# Altium schematic sheet Top-level.SchDoc: nRF54L15 miniDevKit
size A4; Date: 15.03.2026; Author: Vamsi Krishna Sesham; DrawnBy: Vamsi Krishna Sesham; Revision: C; SheetNumber: 1; SheetTotal: 6
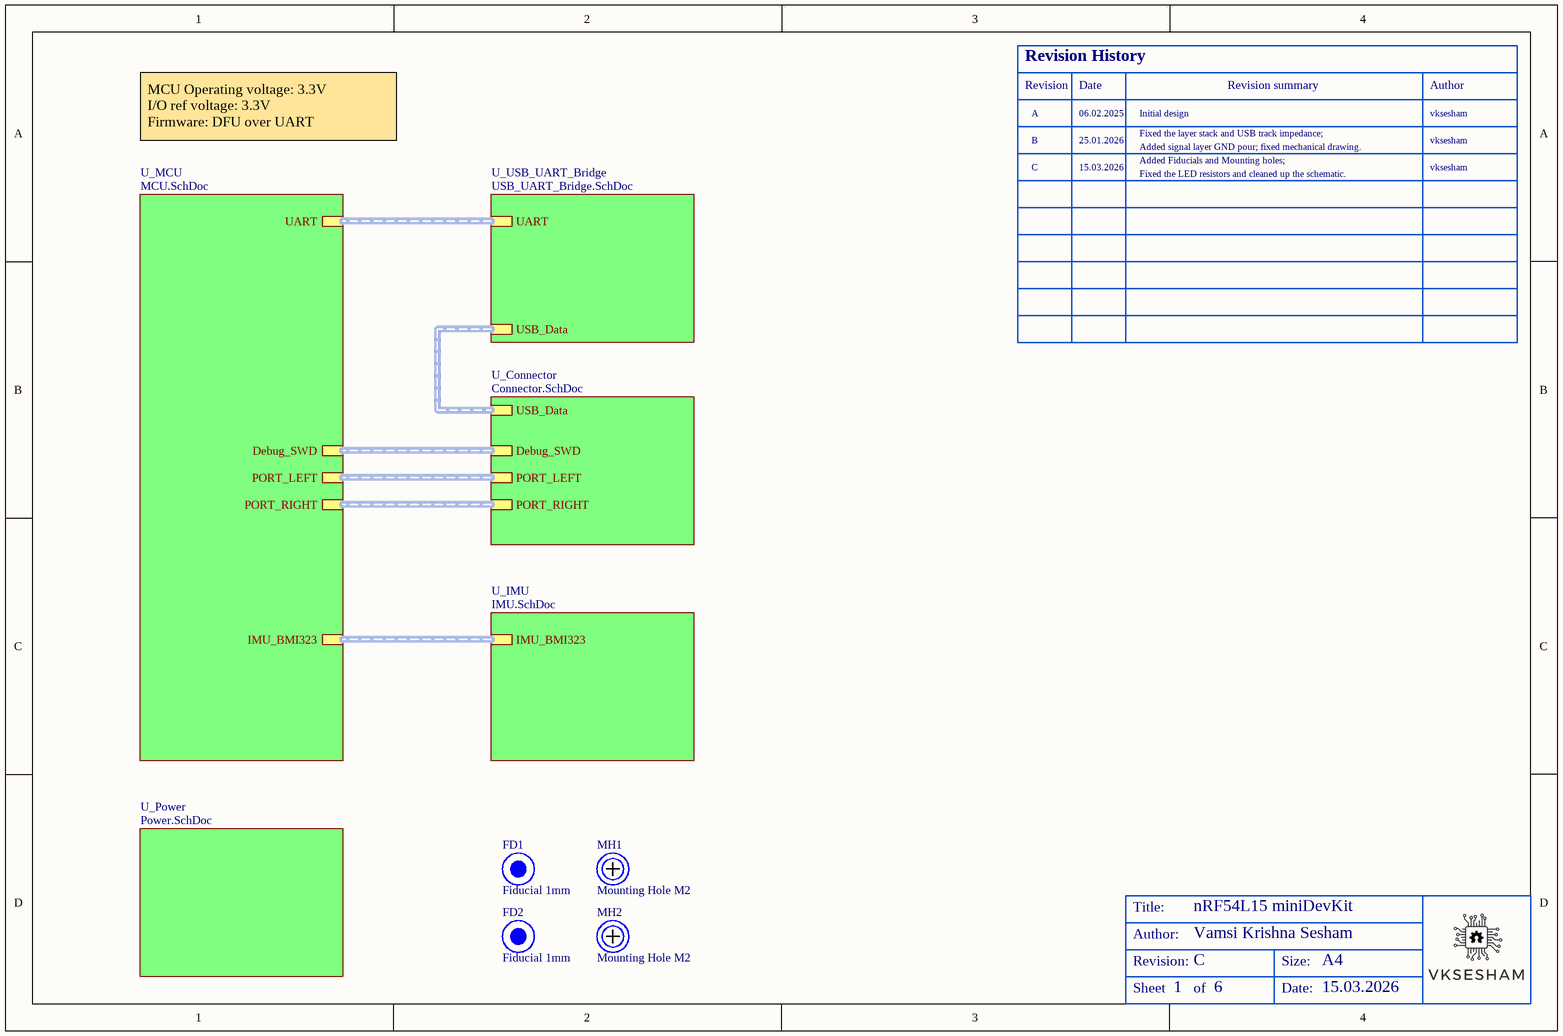
[diagram p0: Top-level.SchDoc]

## Parts
(Parts that share a designator on the sheet are numbered #1, #2 ... from top to bottom, then left to right.)
*#1  RevisionHistory  (value not drawn)  (graphical)
*#2  TitleBlock  (value not drawn)  (graphical)
FD1  Fiducial 1mm  [Fiducial_1mm]  (no BOM)
FD2  Fiducial 1mm  [Fiducial_1mm]  (no BOM)
MH1  Mounting Hole M2  [Mounting Hole M2]  (no BOM)
MH2  Mounting Hole M2  [Mounting Hole M2]  (no BOM)

## Sub-sheets
U_Connector = Connector.SchDoc: USB_Data (harness USB), Debug_SWD (harness SWD), PORT_LEFT (harness Conn_R), PORT_RIGHT (harness Conn_L)
U_IMU = IMU.SchDoc: IMU_BMI323 (harness IMU)
U_MCU = MCU.SchDoc: UART (harness USB_UART), IMU_BMI323 (harness IMU), Debug_SWD (harness SWD), PORT_LEFT (harness Conn_R), PORT_RIGHT (harness Conn_L)
U_Power = Power.SchDoc: no entries
U_USB_UART_Bridge = USB_UART_Bridge.SchDoc: USB_Data (harness USB), UART (harness USB_UART)

## Buses and harness runs
harness sheet U_Connector/Debug_SWD = sheet U_MCU/Debug_SWD
harness sheet U_Connector/PORT_LEFT = sheet U_MCU/PORT_LEFT
harness sheet U_Connector/PORT_RIGHT = sheet U_MCU/PORT_RIGHT
harness sheet U_Connector/USB_Data = sheet U_USB_UART_Bridge/USB_Data
harness sheet U_IMU/IMU_BMI323 = sheet U_MCU/IMU_BMI323
harness sheet U_MCU/UART = sheet U_USB_UART_Bridge/UART

## Notes on the sheet
- A
- 06.02.2025
- Initial design
- vksesham
- MCU Operating voltage: 3.3V
  I/O ref voltage: 3.3V
  Firmware: DFU over UART
- B
- C
- 25.01.2026
- 15.03.2026
- Fixed the layer stack and USB track impedance;
- Added signal layer GND pour; fixed mechanical drawing.
- Added Fiducials and Mounting holes;
- Fixed the LED resistors and cleaned up the schematic.
- (in symbol RevisionHistory) Revision History; Revision; Date; Revision summary; Author
- (in symbol TitleBlock) Title:; Author:; Revision:; Size:; A4; Sheet; of; Date: